# EAGLE design UCirKitUserStudy4-2 (EAGLE 7.3.0)
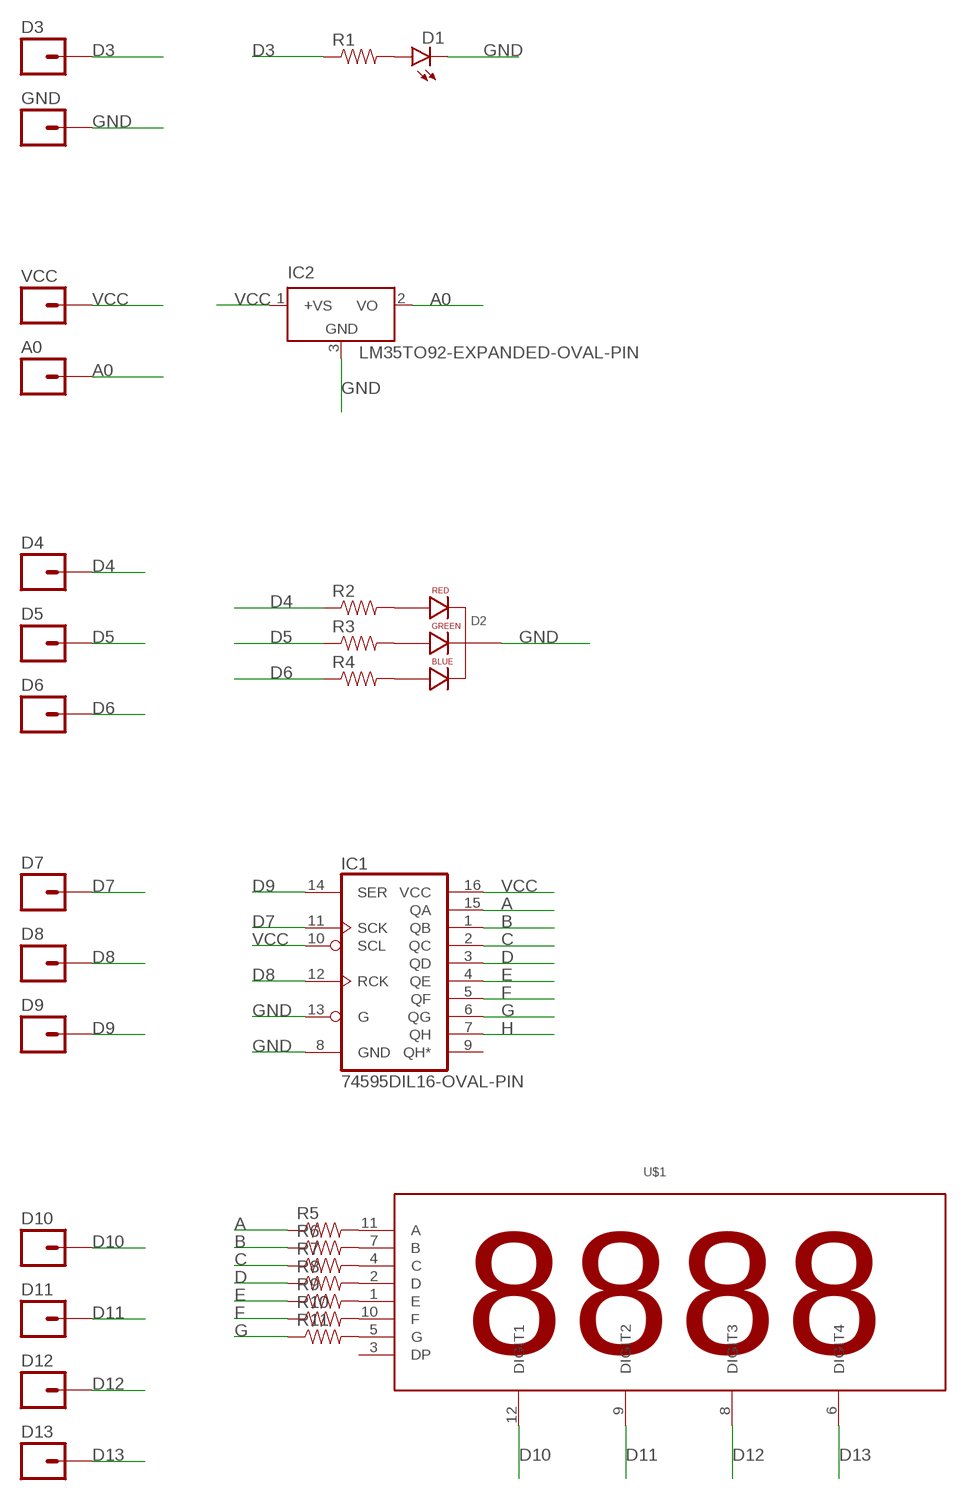
[diagram p0: schematic, sheet 1]

## Parts
A0  M01OVAL_PIN  [1X01_OVAL_PIN]
D1  LEDLED3MM-EXPANDED-OVAL-PIN  [LED3MM-EXPANDED-OVAL-PIN]
D2  LED-RGB-CC-THRULED-RGB-THRU-EXPANDED-OVAL-PIN  [LED-RGB-THRU-EXPANDED-OVAL-PIN]
D3  M01OVAL_PIN  [1X01_OVAL_PIN]
D4  M01OVAL_PIN  [1X01_OVAL_PIN]
D5  M01OVAL_PIN  [1X01_OVAL_PIN]
D6  M01OVAL_PIN  [1X01_OVAL_PIN]
D7  M01OVAL_PIN  [1X01_OVAL_PIN]
D8  M01OVAL_PIN  [1X01_OVAL_PIN]
D9  M01OVAL_PIN  [1X01_OVAL_PIN]
D10  M01OVAL_PIN  [1X01_OVAL_PIN]
D11  M01OVAL_PIN  [1X01_OVAL_PIN]
D12  M01OVAL_PIN  [1X01_OVAL_PIN]
D13  M01OVAL_PIN  [1X01_OVAL_PIN]
GND  M01OVAL_PIN  [1X01_OVAL_PIN]
IC1  74595DIL16-OVAL-PIN  [DIL16-OVAL-PIN]
IC2  LM35TO92-EXPANDED-OVAL-PIN  [TO92-EXPANDED-OVAL-PIN]
R1  1KOHM-1/4W-1%(PTH)PTH-EXPANDED-OVAL-PIN  [PTH-EXPANDED-OVAL-PIN]
R2  1KOHM-1/4W-1%(PTH)PTH-EXPANDED-OVAL-PIN  [PTH-EXPANDED-OVAL-PIN]
R3  1KOHM-1/4W-1%(PTH)PTH-EXPANDED-OVAL-PIN  [PTH-EXPANDED-OVAL-PIN]
R4  1KOHM-1/4W-1%(PTH)PTH-EXPANDED-OVAL-PIN  [PTH-EXPANDED-OVAL-PIN]
R5  1KOHM-1/4W-1%(PTH)PTH-EXPANDED-OVAL-PIN  [PTH-EXPANDED-OVAL-PIN]
R6  1KOHM-1/4W-1%(PTH)PTH-EXPANDED-OVAL-PIN  [PTH-EXPANDED-OVAL-PIN]
R7  1KOHM-1/4W-1%(PTH)PTH-EXPANDED-OVAL-PIN  [PTH-EXPANDED-OVAL-PIN]
R8  1KOHM-1/4W-1%(PTH)PTH-EXPANDED-OVAL-PIN  [PTH-EXPANDED-OVAL-PIN]
R9  1KOHM-1/4W-1%(PTH)PTH-EXPANDED-OVAL-PIN  [PTH-EXPANDED-OVAL-PIN]
R10  1KOHM-1/4W-1%(PTH)PTH-EXPANDED-OVAL-PIN  [PTH-EXPANDED-OVAL-PIN]
R11  1KOHM-1/4W-1%(PTH)PTH-EXPANDED-OVAL-PIN  [PTH-EXPANDED-OVAL-PIN]
U$1  4DIGIT_SEVEN_SEGMENT4DIGIT_SEVEN_SEGMENT_OVAL_PIN  [4DIGIT_SEVEN_SEGMENT_OVAL_PIN]
VCC  M01OVAL_PIN  [1X01_OVAL_PIN]

## Nets
A: IC1.15(QA) R5.P$1
A0: A0.1 IC2.2(VO)
B: IC1.1(QB) R6.P$1
C: IC1.2(QC) R7.P$1
D: IC1.3(QD) R8.P$1
D3: D3.1 R1.P$1
D4: D4.1 R2.P$1
D5: D5.1 R3.P$1
D6: D6.1 R4.P$1
D7: D7.1 IC1.11(SCK)
D8: D8.1 IC1.12(RCK)
D9: D9.1 IC1.14(SER)
D10: D10.1 U$1.12(DIGIT1)
D11: D11.1 U$1.9(DIGIT2)
D12: D12.1 U$1.8(DIGIT3)
D13: D13.1 U$1.6(DIGIT4)
E: IC1.4(QE) R9.P$1
F: IC1.5(QF) R10.P$1
G: IC1.6(QG) R11.P$1
GND: D1.K(C) D2.2(CATHODE) GND.1 IC1.8(GND) IC1.13(G) IC2.3(GND)
H: IC1.7(QH)
N$1: D1.A R1.P$2
N$2: D2.1(RED_CATHODE) R2.P$2
N$3: D2.3(GREEN_CATHODE) R3.P$2
N$4: D2.4(BLUE_CATHODE) R4.P$2
N$5: R5.P$2 U$1.11(A)
N$6: R6.P$2 U$1.7(B)
N$7: R7.P$2 U$1.4(C)
N$8: R8.P$2 U$1.2(D)
N$9: R9.P$2 U$1.1(E)
N$10: R10.P$2 U$1.10(F)
N$11: R11.P$2 U$1.5(G)
VCC: IC1.10(SCL) IC1.16(VCC) IC2.1(+VS) VCC.1
Unconnected: IC1.9(QH*) U$1.3(DP)

## Library data of the parts
A0 D3-D13 GND VCC = SparkFun-Connectors:M01: Header 1 Standard 1-pin 0.1" header. Use with straight break away headers (SKU : PRT-00116), right angle break away headers (PRT-00553), swiss pins (PRT-00743), machine pins (PRT-00117), and female headers (PRT-00115).
D1 = SparkFun-LED:LED: LEDs Standard schematic elements and footprints for 5mm, 3mm, 1206, and 0603 sized LEDs. 5mm - Spark Fun Electronics SKU : COM-00529 (and others)
D2 = SparkFun-LED:LED-RGB-CC-THRU: RGB Through-hole common cathode LED SparkFun Storefront: COM-00105 (Clear) COM-09264 (Diffuse)
IC1 = SparkFun-DigitalIC:74*595: 8-bit SHIFT REGISTER, output latch
IC2 = lm35:LM35: Single-Supply Centigrade Temperature Sensor Vout = (10mV/°C x Temp °C) +5mmmV Source: http://www.national.com/ds/LM/LM35.pdf
R1-R11 = SparkFun-Resistors:1KOHM-1/4W-1%(PTH): RES-12182
U$1 = led-7-segment:4DIGIT_SEVEN_SEGMENT

## Board
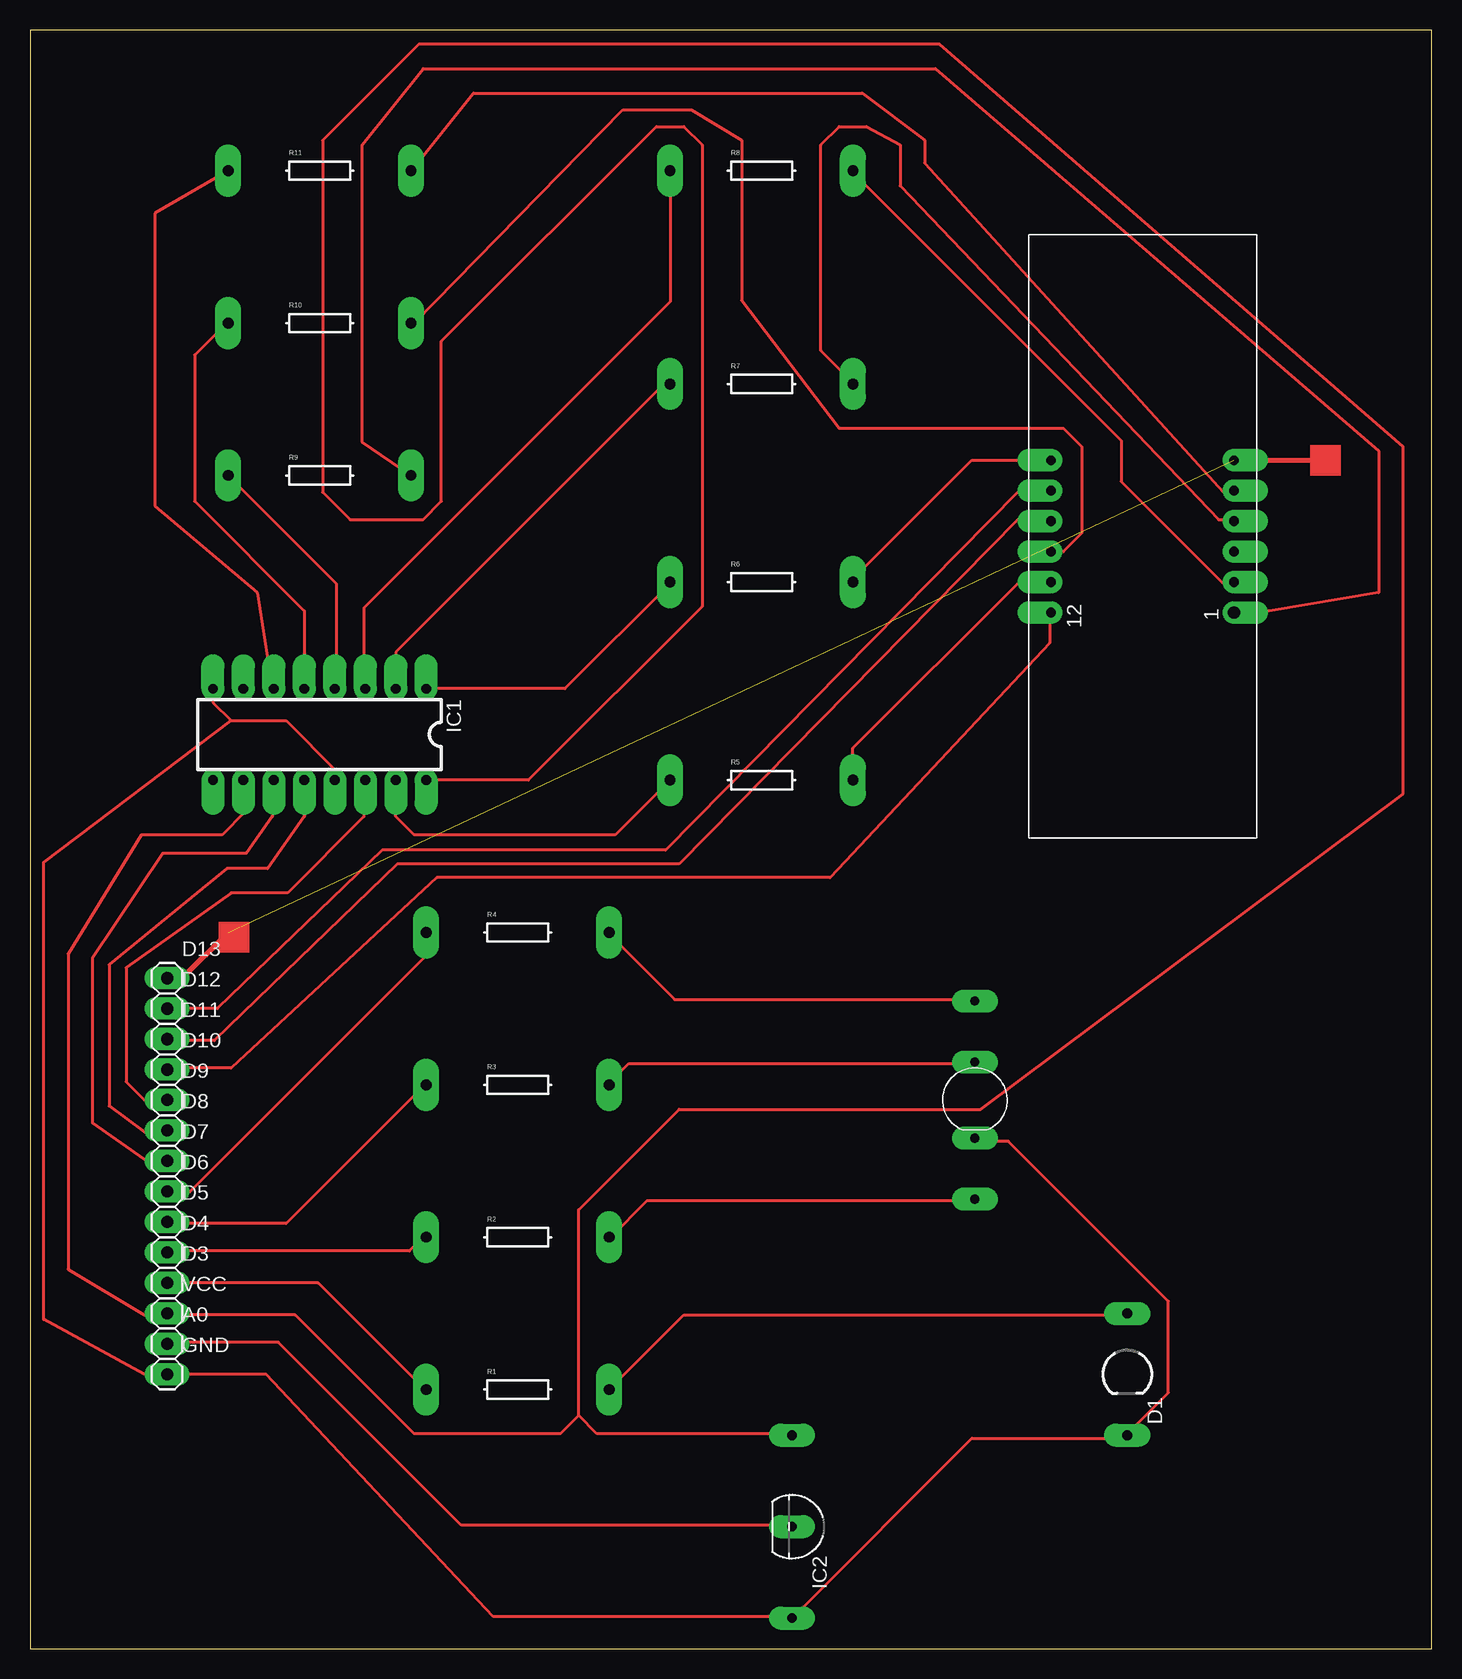
[diagram p1: board, top side]

Size 116.82 x 134.92 mm. Coordinates in mm from the lower left corner, seen from the top.
Outline: 0,0 116.82,0 116.82,134.92 0,134.92 0,0
Copper layers (1*16): Top 0.035mm / dielectric 1.5mm / Bottom 0.035mm
Design rules "default *": minimum track width 10mil, minimum drill 24mil, track to track 20mil, track to pad 50mil, pad to pad 9mil, via to via 9mil, smd to smd 8mil, copper to edge 40mil, drill to drill 8mil, minimum pad ring 10mil, minimum via ring 8mil, stop-mask expansion 4mil, vias tented up to drill 0mil, thermal gap 10mil

### Footprints (pad centres in the part's own frame; a part is rotated, then mirrored left to right if it is on the bottom)
1X01_OVAL_PIN = drill 1.016 pad 1.88 long: 1 0,0
LED3MM-EXPANDED-OVAL-PIN = drill 0.813 pad 1.93 long: A -5.08,0; K 5.08,0
LED-RGB-THRU-EXPANDED-OVAL-PIN = drill 0.762 pad 1.93 long: 1 8.255,0; 2 3.175,0; 3 -3.175,0; 4 -8.255,0
DIL16-OVAL-PIN = drill 0.813 pad 1.93 offset: 1 -8.89,-3.81; 2 -6.35,-3.81; 3 -3.81,-3.81; 4 -1.27,-3.81; 5 1.27,-3.81; 6 3.81,-3.81; 7 6.35,-3.81; 8 8.89,-3.81; 9 8.89,3.81; 10 6.35,3.81; 11 3.81,3.81; 12 1.27,3.81; 13 -1.27,3.81; 14 -3.81,3.81; 15 -6.35,3.81; 16 -8.89,3.81
TO92-EXPANDED-OVAL-PIN = drill 0.813 pad 1.93 long: 1 -7.62,0; 2 0,0; 3 7.62,0
PTH-EXPANDED-OVAL-PIN = drill 0.9 pad 2.184 long: P$1 -7.62,0; P$2 7.62,0
4DIGIT_SEVEN_SEGMENT_OVAL_PIN = drill 1.016 pad 1.88 offset: 1 -6.35,-7.62 | drill 0.8 pad 1.88 offset: 2 -3.81,-7.62; 3 -1.27,-7.62; 4 1.27,-7.62; 5 3.81,-7.62; 6 6.35,-7.62; 7 6.35,7.62; 8 3.81,7.62; 9 1.27,7.62; 10 -1.27,7.62; 11 -3.81,7.62; 12 -6.35,7.62

### Placement (x,y rotation side)
A0  11.43,25.4 0 top
D1  91.44,22.86 270 top
D2  78.74,45.72 270 top
D3  11.43,30.48 0 top
D4  11.43,33.02 0 top
D5  11.43,35.56 0 top
D6  11.43,38.1 0 top
D7  11.43,40.64 0 top
D8  11.43,43.18 0 top
D9  11.43,45.72 0 top
D10  11.43,48.26 0 top
D11  11.43,50.8 0 top
D12  11.43,53.34 0 top
D13  11.43,55.88 0 top
GND  11.43,22.86 0 top
IC1  24.13,76.2 180 top
IC2  63.5,10.16 270 top
R1  40.64,21.59 0 top
R2  40.64,34.29 0 top
R3  40.64,46.99 0 top
R4  40.64,59.69 0 top
R5  60.96,72.39 0 top
R6  60.96,88.9 0 top
R7  60.96,105.41 0 top
R8  60.96,123.19 0 top
R9  24.13,97.79 0 top
R10  24.13,110.49 0 top
R11  24.13,123.19 0 top
U$1  92.71,92.71 90 top
VCC  11.43,27.94 0 top

### Tracks (layer width: path | path; a pad name or v marks a point on that pad's centre or on a via)
A
  Top 0.254: IC1.15 30.48,69.34 32,67.82 48.77,67.82 R5.P$1
A0
  Top 0.254: A0.1 11.43,25.53 20.7,25.53 35.94,10.29 63.25,10.29 IC2.2
B
  Top 0.254: IC1.1 44.58,80.01 53.34,88.77 R6.P$1
C
  Top 0.254: IC1.2 30.48,83.06 52.58,105.16 53.34,105.16 R7.P$1
D
  Top 0.254: R8.P$1 53.34,112.27 27.81,86.74 27.81,80.01 IC1.3
D3
  Top 0.254: D3.1 24,30.48 32.77,21.72 R1.P$1
D4
  Top 0.254: D4.1 11.43,33.15 31.62,33.15 32.77,34.29 R2.P$1
D5
  Top 0.254: D5.1 11.43,35.43 21.34,35.43 32.77,46.86 R3.P$1
D6
  Top 0.254: D6.1 13.34,38.1 32.77,57.53 32.77,59.44 R4.P$1
D7
  Top 0.254: D7.1 11.43,40.77 9.53,40.77 5.21,43.81 5.21,57.53 11.05,66.29 18.03,66.29 20.19,69.34 20.19,72.39 IC1.11
D8
  Top 0.254: IC1.12 22.86,69.34 19.81,65.02 16.38,65.02 6.6,57.02 6.6,45.21 9.53,43.05 11.43,43.05 D8.1
D9
  Top 0.254: D9.1 9.53,45.72 8,47.24 8,56.77 16.76,62.99 21.46,62.99 27.81,69.34 27.81,72.39 IC1.14
D10
  Top 0.254: D10.1 11.43,48.39 16.76,48.39 33.91,64.26 66.67,64.26 84.96,83.82 84.96,86.11 U$1.12
D11
  Top 0.254: D11.1 11.43,50.67 15.37,50.67 30.61,65.41 54.1,65.41 82.3,94.11 84.96,94.11 U$1.9
D12
  Top 0.254: D12.1 15.62,53.34 29.34,66.55 52.96,66.55 82.3,96.39 84.96,96.39 U$1.8
D13  (1 unrouted)
  Top 0.406: U$1.6 107.95,99.06 | D13.1 12.7,55.88 16.51,59.69
E
  Top 0.254: R9.P$1 25.53,88.77 25.53,80.01 IC1.4
F
  Top 0.254: IC1.5 22.86,86.49 13.72,95.63 13.72,107.82 16.38,110.49 R10.P$1
G
  Top 0.254: R11.P$1 10.41,119.63 10.41,95.25 18.92,88.01 20.19,80.01 IC1.6
GND
  Top 0.254: 16.76,77.34 21.34,77.34 25.53,73.15 25.53,72.39 IC1.13 | 16.76,77.34 15.24,78.87 IC1.8 | D2.2 78.87,42.29 81.53,42.29 94.87,28.96 94.87,21.34 91.44,17.91 D1.K 91.44,17.53 78.49,17.53 IC2.3 63.25,2.67 38.61,2.67 19.68,22.86 GND.1 9.53,22.86 1.14,27.43 1.14,65.53 16.76,77.34
N$1
  Top 0.254: R1.P$2 54.48,27.81 91.44,27.81 D1.A
N$2
  Top 0.254: D2.1 78.49,37.34 51.44,37.34 48.39,34.29 R2.P$2
N$3
  Top 0.254: D2.3 78.49,48.77 49.91,48.77 48.39,47.24 R3.P$2
N$4
  Top 0.254: D2.4 78.49,54.1 53.72,54.1 48.39,59.44 R4.P$2
N$5
  Top 0.254: R5.P$2 68.58,75.06 82.3,88.77 84.96,88.77 U$1.11
N$6
  Top 0.254: U$1.7 78.49,99.06 68.58,89.15 R6.P$2
N$7
  Top 0.254: U$1.4 100.2,94.11 99.06,94.11 72.52,121.92 72.52,125.35 69.72,126.87 67.44,126.87 65.91,125.35 65.91,108.2 68.58,105.54 R7.P$2
N$8
  Top 0.254: U$1.2 100.2,88.77 99.44,88.77 90.93,97.28 90.93,100.71 68.58,123.06 R8.P$2
N$9
  Top 0.254: R9.P$2 27.69,100.58 27.69,125.35 32.77,131.7 75.44,131.7 112.39,99.82 112.39,88.01 103.25,86.49 100.58,86.49 U$1.1
N$10
  Top 0.254: U$1.10 86.11,91.44 87.63,92.96 87.63,100.2 86.11,101.73 67.44,101.73 59.31,112.39 59.31,125.73 55.12,128.27 49.4,128.27 32,110.49 R10.P$2
N$11
  Top 0.254: R11.P$2 36.96,129.67 69.34,129.67 74.55,125.73 74.55,123.83 99.44,96.39 100.2,96.39 U$1.5
VCC
  Top 0.254: 11.43,27.81 9.53,27.81 3.17,31.62 3.17,57.91 9.27,67.82 16,67.82 17.91,69.72 17.91,72.39 IC1.10 | IC1.16 41.53,72.39 56.01,86.87 56.01,125.35 54.48,126.87 52.2,126.87 34.29,108.97 34.29,95.63 32.77,94.11 26.67,94.11 24.38,96.39 24.38,125.73 32.38,133.73 75.82,133.73 114.43,100.2 114.43,71.25 79.25,44.96 54.1,44.96 45.72,36.58 45.72,19.43 | 45.72,19.43 47.24,17.91 63.25,17.91 IC2.1 | 11.43,27.81 22.1,27.81 32,17.91 44.2,17.91 45.72,19.43 | 11.43,27.81 VCC.1
(copper drawn outside any net)
  shapes: Top area x2